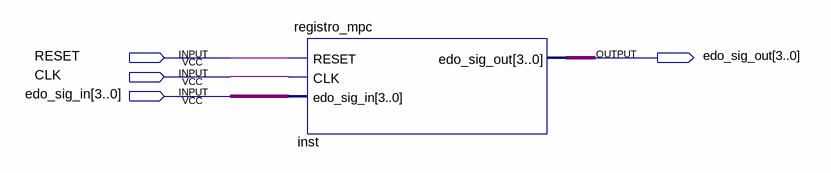
[diagram p0: schematic sheet]
// Quartus schematic reg_mpc.bdf as structural Verilog: 1 symbols, 4 pins
module reg_mpc (
  input  RESET,
  input  CLK,
  input  [3:0] edo_sig_in,
  output [3:0] edo_sig_out
);

  registro_mpc inst (.RESET(RESET), .CLK(CLK), .edo_sig_in(edo_sig_in), .edo_sig_out(edo_sig_out));
endmodule
